# EAGLE design IR (EAGLE 9.5.2)
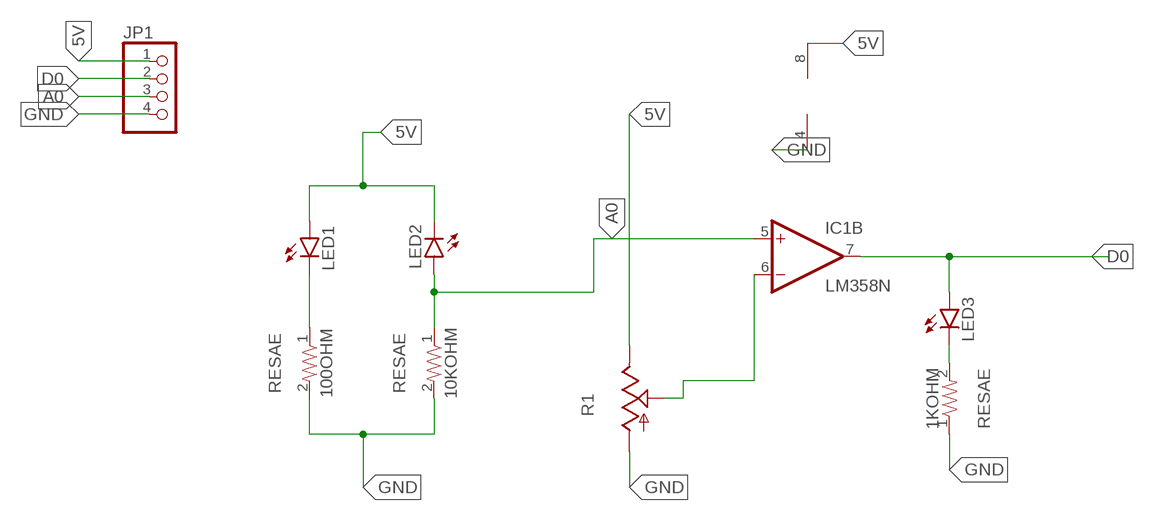
[diagram p0: schematic, sheet 1]

## Parts
1KOHM  RESAE  [RESAD846W63L520D250B]
10KOHM  RESAE  [RESAD846W63L520D250B]
100OHM  RESAE  [RESAD846W63L520D250B]
IC1  LM358N  [DIL08]
JP1  PINHD-1X4/90  [1X04/90]
LED1  LED5MM  [LED5MM]
LED2  LED5MM  [LED5MM]
LED3  LED3MM  [LED3MM]
R1  TRIM_US-CA6V  [CA6V]

## Nets
5V: IC1.8(P:V+) JP1.1 LED1.A LED2.K(C) R1.E
A0: 10KOHM.1 IC1.5(B:+IN) JP1.3 LED2.A
D0: IC1.7(B:OUT) JP1.2 LED3.A
GND: 1KOHM.1 10KOHM.2 100OHM.2 IC1.4(P:V-) JP1.4 R1.A
N$1: 100OHM.1 LED1.K(C)
N$6: IC1.6(B:-IN) R1.S
N$7: 1KOHM.2 LED3.K(C)
Unconnected: IC1.1(A:OUT) IC1.2(A:-IN) IC1.3(A:+IN)

## Library data of the parts
1KOHM 10KOHM 100OHM = SparkFun-Resistors:RESAE
IC1 = linear:LM358: OP AMP also LM158; LM258; LM2904 Source: http://cache.national.com/ds/LM/LM158.pdf
JP1 = pinhead:PINHD-1X4: PIN HEADER
LED1-LED3 = led:LED: LED OSRAM: - CHIPLED LG R971, LG N971, LY N971, LG Q971, LY Q971, LO R971, LY R971 LH N974, LH R974 LS Q976, LO Q976, LY Q976 LO Q996 - Hyper CHIPLED LW Q18S LB Q993, LB Q99A, LB R99A - SideLED LS A670, LO A670, LY A670, LG A670, LP A670 LB A673, LV A673, LT A673, LW A673 LH A674 LY A675 LS A676, LA A676, LO A676, LY A676, LW A676 LS A679, LY A679, LG A679 - Hyper Micro SIDELED® LS Y876, LA Y876, LO Y876, LY Y876 LT Y87S - SmartLED LW L88C, LW L88S LB L89C, LB L89S, LG L890 LS L89K, LO L89K, LY L89K LS L896, LA L896, LO L896, LY L896 - TOPLED LS T670, LO T670, LY T670, LG T670, LP T670 LSG T670, LSP T670, LSY T670, LOP T670, LYG T670 LG T671, LOG T671, LSG T671 LB T673, LV T673, LT T673, LW T673 LH T674 LS T676, LA T676, LO T676, LY T676, LB T676, LH T676, LSB T676, LW T676 LB T67C, LV T67C, LT T67C, LS T67K, LO T67K, LY T67K, LW E67C LS E67B, LA E67B, LO E67B, LY E67B, LB E67C, LV E67C, LT E67C LW T67C LS T679, LY T679, LG T679 LS T770, LO T770, LY T770, LG T770, LP T770 LB T773, LV T773, LT T773, LW T773 LH T774 LS E675, LA E675, LY E675, LS T675 LS T776, LA T776, LO T776, LY T776, LB T776 LHGB T686 LT T68C, LB T68C - Hyper Mini TOPLED® LB M676 - Mini TOPLED Santana® LG M470 LS M47K, LO M47K, LY M47K Source: http://www.osram.convergy.de LUXEON: - LUMILED® LXK2-PW12-R00, LXK2-PW12-S00, LXK2-PW14-U00, LXK2-PW14-V00 LXK2-PM12-R00, LXK2-PM12-S00, LXK2-PM14-U00 LXK2-PE12-Q00, LXK2-PE12-R00, LXK2-PE12-S00, LXK2-PE14-T00, LXK2-PE14-U00 LXK2-PB12-K00, LXK2-PB12-L00, LXK2-PB12-M00, LXK2-PB14-N00, LXK2-PB14-P00, LXK2-PB14-Q00 LXK2-PR12-L00, LXK2-PR12-M00, LXK2-PR14-Q00, LXK2-PR14-R00 LXK2-PD12-Q00, LXK2-PD12-R00, LXK2-PD12-S00 LXK2-PH12-R00, LXK2-PH12-S00 LXK2-PL12-P00, LXK2-PL12-Q00, LXK2-PL12-R00 Source: www.luxeon.com KINGBRIGHT: KA-3528ASYC Source: www.kingbright.com
R1 = pot:TRIM_US-: POTENTIOMETER

## Board
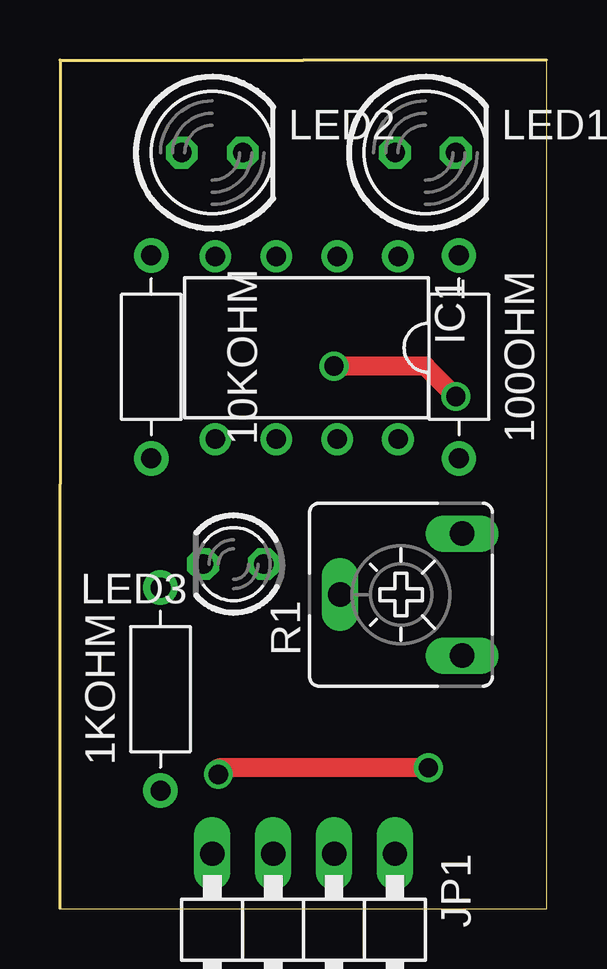
[diagram p1: board, top side]
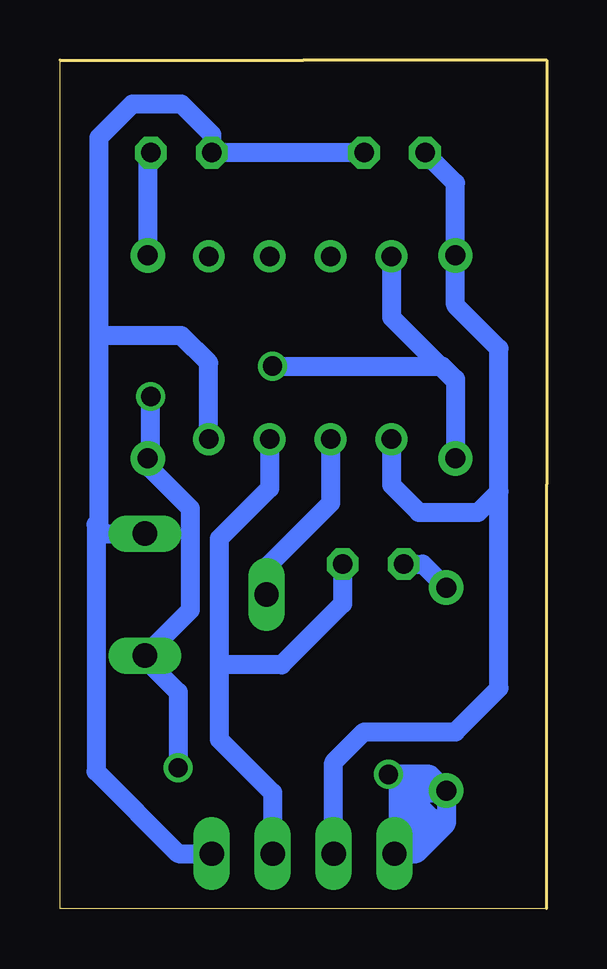
[diagram p2: board, bottom side, seen from below]

Size 20.3 x 35.36 mm. Coordinates in mm from the lower left corner, seen from the top.
Outline: 0,0 20.3,0 20.3,35.36 0,35.36 0,0
Copper layers (1*16): Top 0.035mm / dielectric 1.5mm / Bottom 0.035mm
Design rules "default *": minimum track width 6mil, minimum drill 0.35mm, track to track 0.4mm, track to pad 0.5mm, pad to pad 6mil, via to via 6mil, smd to smd 6mil, copper to edge 40mil, drill to drill 6mil, minimum pad ring 10mil, minimum via ring 8mil, stop-mask expansion 4mil, vias tented up to drill 0mil, thermal gap 10mil

### Footprints (pad centres in the part's own frame; a part is rotated, then mirrored left to right if it is on the bottom)
RESAD846W63L520D250B = drill 0.83 pad 1.43: 1 -4.23,0; 2 4.23,0
DIL08 = drill 0.813 pad 1.27: 1 -3.81,-3.81; 2 -1.27,-3.81; 3 1.27,-3.81; 4 3.81,-3.81; 5 3.81,3.81; 6 1.27,3.81; 7 -1.27,3.81; 8 -3.81,3.81
1X04/90 = drill 1.016 long: 1 -3.81,-3.81; 2 -1.27,-3.81; 3 1.27,-3.81; 4 3.81,-3.81
LED5MM = drill 0.813 octagon: A -1.27,0; K 1.27,0
LED3MM = drill 0.813 octagon: A -1.27,0; K 1.27,0
CA6V = drill 1.016 long: A -2.54,-2.54; E 2.54,-2.54; S 0,2.54

### Placement (x,y rotation side)
1KOHM  4.19,9.14 90 top
10KOHM  3.81,22.99 270 top
100OHM  16.64,22.99 270 top
IC1  10.29,23.37 180 top
JP1  10.16,-1.52 180 top
LED1  15.24,31.5 0 top
LED2  6.35,31.5 0 top
LED3  7.24,14.35 180 top
R1  14.22,13.08 90 top

### Tracks (layer width: path | path; a pad name or v marks a point on that pad's centre or on a via)
5V
  Bottom 0.8: LED2.K LED1.A 13.97,32.26 15.24,33.53 17.27,33.53 18.67,32.13 18.67,23.88 | 18.67,15.88 18.8,16 18.8,5.72 15.37,2.29 JP1.1 | 18.67,15.88 18.41,15.62 R1.E | 18.67,15.88 18.67,23.88 | 18.67,23.88 15.24,23.88 14.1,22.73 IC1.8
A0
  Bottom 0.8: LED2.A 3.81,30.23 10KOHM.1 3.81,25.15 1.99,23.33 1.99,17.37 | IC1.5 6.48,17.65 5.33,16.51 2.86,16.51 1.99,17.37 | 9.02,2.92 9.02,2.41 JP1.3 8.89,6.1 7.62,7.37 3.81,7.37 1.99,9.18 1.99,17.37
D0
  Bottom 0.8: 8.51,14.48 LED3.A 8.51,12.7 11.05,10.16 13.66,10.16 | 11.56,2.41 JP1.2 11.43,4.83 13.66,7.05 13.66,8.64 13.66,10.16 | IC1.7 11.56,17.51 13.66,15.41 13.66,10.16
GND  (via drill 0.8)
  Top 0.8: v15.37,5.86 6.63,5.86 v6.6,5.59 | v16.51,21.34 15.24,22.61 v11.43,22.61
  Bottom 0.8: IC1.4 6.48,24.64 3.94,22.1 3.94,22.19 | 3.94,22.19 3.81,22.06 10KOHM.2 | 4.19,3.52 5.42,2.29 JP1.4 | 4.19,4.83 1KOHM.1 4.87,5.59 v6.6,5.59 | 4.19,4.83 4.19,3.52 | v15.37,5.86 15.37,9.02 16.76,10.41 R1.A 14.86,12.45 14.86,16.66 16.64,18.45 100OHM.2 16.51,18.88 v16.51,21.34 | 6.18,5.17 v6.6,5.59 | 6.42,2.35 JP1.4 | JP1.4 6.18,2.45 6.18,3.56 | 6.18,3.56 6.18,5.17 | v11.43,22.61 4.36,22.61 3.94,22.19 | 4.19,3.52 4.53,3.52 4.83,3.81 | 4.83,3.81 5.46,4.44 | 5.46,4.44 6.18,5.17 | v6.6,5.59 5.84,4.83 4.19,4.83 | JP1.4 4.83,3.81 | 5.46,4.44 5.46,4.28 6.18,3.56
N$1
  Bottom 0.8: LED1.K 16.64,31.37 100OHM.1
N$6
  Bottom 0.8: R1.S 11.68,14.22 9.02,16.89 IC1.6
N$7
  Bottom 0.8: LED3.K 5.17,14.35 1KOHM.2